# Altium schematic sheet Main.SchDoc
size 393 x 281 mm; SheetNumber: 1; SheetTotal: 1
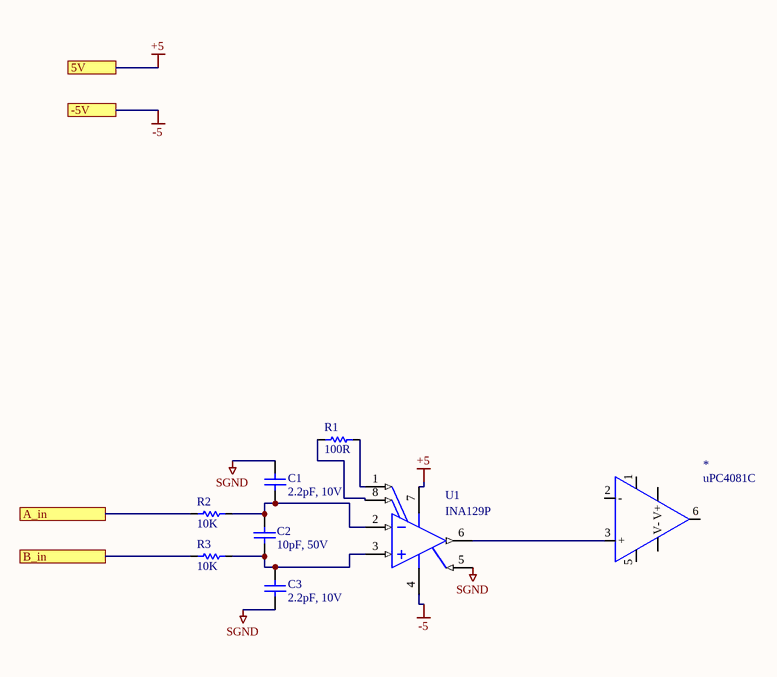
[diagram p0: Main.SchDoc]

## Parts
*  uPC4081C
C1  2.2pF, 10V  [0402 capacitor, IPC Medium Density]
C2  10pF, 50V  [0402 capacitor, IPC Medium Density]
C3  2.2pF, 10V  [0402 capacitor, IPC Medium Density]
R1  100R  [RESC1005X04M]
R2  10K  [RESC1005X04N]
R3  10K  [RESC1005X04N]
U1  INA129P  [P0008A]

## Ports
5V, -5V, A_in, B_in

## Nets
+5: U1.7(V+) ; port 5V
-5: U1.4(V-) ; port -5V
SGND: C1.2 C3.1 U1.5(REF)
A_in: R2.1 ; port A_in
B_in: R3.1 ; port B_in
Net*_3: *.3(+) U1.6(VO)
NetC1_1: C1.1 C2.1 R2.2 U1.2(VIN-)
NetC2_2: C2.2 C3.2 R3.2 U1.3(VIN+)
NetR1_1: R1.1 U1.8(RG)
NetR1_2: R1.2 U1.1(RG)

Not connected (* = marked no-connect by the designer): * 1(offset) 2(-) 4(V-) 5(Offset) 6(O) 7(V+)

## Notes on the sheet
- Project
- Name
- Sheet
- A3
- Rev
- Designer
- /
- Date

## Library data of the parts
* = CMP-00252.0.2: Operational Amplifier, 1 Func, 20000uV Offset-Max, BIPolar, PDIP8; Input Offset Voltage-Max: 20mV; Average Bias Current-Max (IIB): 10nA; Low-Bias: Yes; Nominal Supply Voltage: 15V; Input Offset Current-Max (IIO): 200pA; Bias Current-Max (IIB) @25C: 400pA; Neg Supply Voltage Limit-Max: -18V; Max Supply Current: 2.8mA; Channels: 1; Supply Voltage Limit-Max: 18V; Surface Mount: No; Voltage Gain-Min: 25000; Package Equivalence Code: DIP8,.3; Qualification Status: Not Qualified; Common-mode Reject Ratio-Nom: 76dB; Power Supplies: +-15V; Neg Supply Voltage-Nom (Vsup): -15V; Low-Offset: No; Package Body Material: Plastic; Unity Gain BW-Nom: 3MHz; Architecture: VOLTAGE-FEEDBACK; Slew Rate: 13V/µs; Case/Package: DIP; Package Style: IN-LINEMeter; JESD-609 Code: e0; Pins: 8; Temperature Grade: OTHER; Terminal Form: Through Hole; Frequency Compensation: YES; Amplifier Type: OPERATIONAL AMPLIFIER; Height - Seated (Max): 5.08mm; JESD-30 Code: R-PDIP-T8; Terminal Finish: Tin; Width: 7.62mm; Terminal Position: DUAL; Max Operating Temperature: 70°C; Length: 10.16mm; RoHS Compliant: No; Technology: BIPOLAR; Terminal Pitch: 2.54mm; Min Operating Temperature: -20°C; Package Shape: Rectangular
C1 C3 = CMP-001-N69-2: 2.2uF, 10V, 10%, X7R, 0402
C2 = CMP-001-M79-1: 12pF, 50V, 2%, NP0, 0402
R1 = CMP-001-M00-1: 100R, 1%, 1/16W, 0402
R2 R3 = CMP-001-N91-2: 10K, 1%, 1/16W, 0402
U1 = CMP-0992-00137-2: Precision, Low Power Instrumentation Amplifier, -40 to 125 degC, 8-pin DIP (P8), Green (RoHS & no Sb/Br); Manufacturer: Texas Instruments; Input Offset Drift (+/-)(Max)(uV/Degrees Celsius): 0.5; Input Bias Current (+/-)(Max)(nA): 5; Non-Linearity (+/-)(Max)(%): 0.002; Input Offset (+/-)(Max)(uV): 50; Gain(V/V): 1 to 10000; Output Offset Drift (+/-)(Max)(uV/Degrees Celsius): 20/G; Output Offset (+/-)(Max)(uV): 500/G; Number of Channels: 1; Vs(Max)(V): 36; SubFamily: Dual Supply; Vs(Min)(V): 4.5; CMRR(Min)(dB): 120; Quiescent Current (+/-)(Typ)(mA): 0.7; Noise at 1kHz(Typ)(nV/rt(Hz)): 8; ComponentLink3URL: http://www.ti.com/litv/pdf/mpdi001b; PackageVersion: 4040082/E, 04/2010; PartNumber: INA129P; ComponentLink2URL: http://www.ti.com/general/docs/lit/getliterature.tsp?genericPartNumber=INA129&fileType=pdf; ComponentLink3Description: Package Specification; Eco-Plan: Green (RoHS & no Sb/Br); ComponentLink1URL: http://www.ti.com/; ComponentLink1Description: Manufacturer URL; PackageDescription: 8-Pin Plastic In-Line, Body 9.59 x 6.35 mm, Pitch 2.54 mm; DatasheetVersion: SBOS051B; Code_JEDEC: MS-001; Mounting Technology: Through Hole; PackageReference: P0008A; ComponentLink2Description: Datasheet